# EAGLE design untitled (EAGLE 6.1)
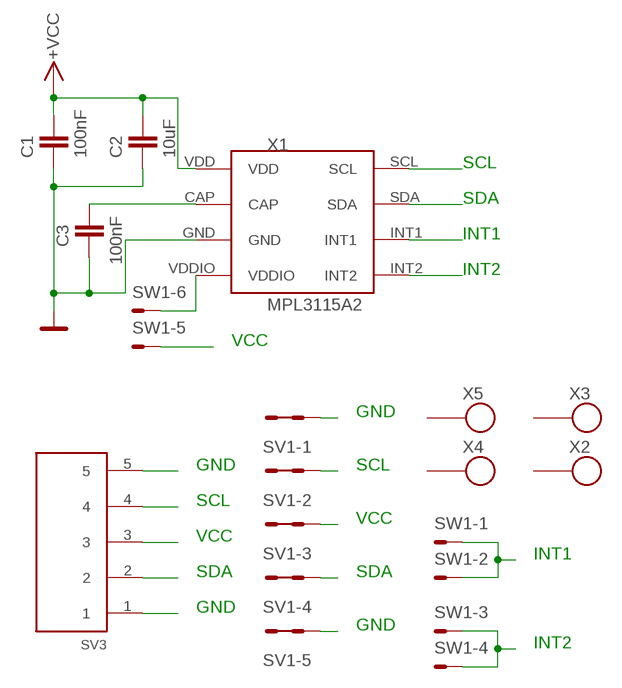
[diagram p0: schematic, sheet 1]

## Parts
C1  100nF  C-EUC0805  [C0805]
C2  10uF  C-EUC0805  [C0805]
C3  100nF  C-EUC0805  [C0805]
SV1  MA05-2  [MA05-2]
SV3  SMD_MA05-01  [SMD_MA05-1]
SW1  MA03-3  [MA03-2]
X1  MPL3115A2  [LGA]
X2  SROUB3M  [SROUB3M]
X3  SROUB3M  [SROUB3M]
X4  SROUB3M  [SROUB3M]
X5  SROUB3M  [SROUB3M]

## Nets
GND: C1.2 C2.2 C3.2 SV1.1 SV1.2 SV1.9 SV1.10 SV3.1 SV3.5 X1.GND
INT1: SW1.1 SW1.2 X1.INT1
INT2: SW1.3 SW1.4 X1.INT2
N$1: SW1.6 X1.VDDIO
N$3: C3.1 X1.CAP
SCL: SV1.3 SV1.4 SV3.4 X1.SCL
SDA: SV1.7 SV1.8 SV3.2 X1.SDA
VCC: C1.1 C2.1 SV1.5 SV1.6 SV3.3 SW1.5 X1.VDD ; supply symbol labelled +VCC
Unconnected: X2.P$1 X3.P$1 X4.P$1 X5.P$1

## Notes on the sheet
- SCL
- SDA
- INT1
- INT2
- VCC
- X5
- GND
- GND | SCL
- SCL
- VCC
- VCC
- INT1
- SDA | SDA
- GND
- GND
- INT2

## Library data of the parts
C1-C3 = rcl:C-EU: CAPACITOR, European symbol
SV1 = moje_hrebinky:MA05-2: PIN HEADER; OC_FARNELL: unknown; OC_NEWARK: unknown
SV3 = moje_hrebinky:SMD_MA05-01
SW1 = moje_hrebinky:MA03-3
X1 = moje_cidla:MPL3115A2: DIGITALNI CIDLO TLAKU A TEPLOTY MPL3115A2
X2-X5 = moje:SROUB3M

## Board
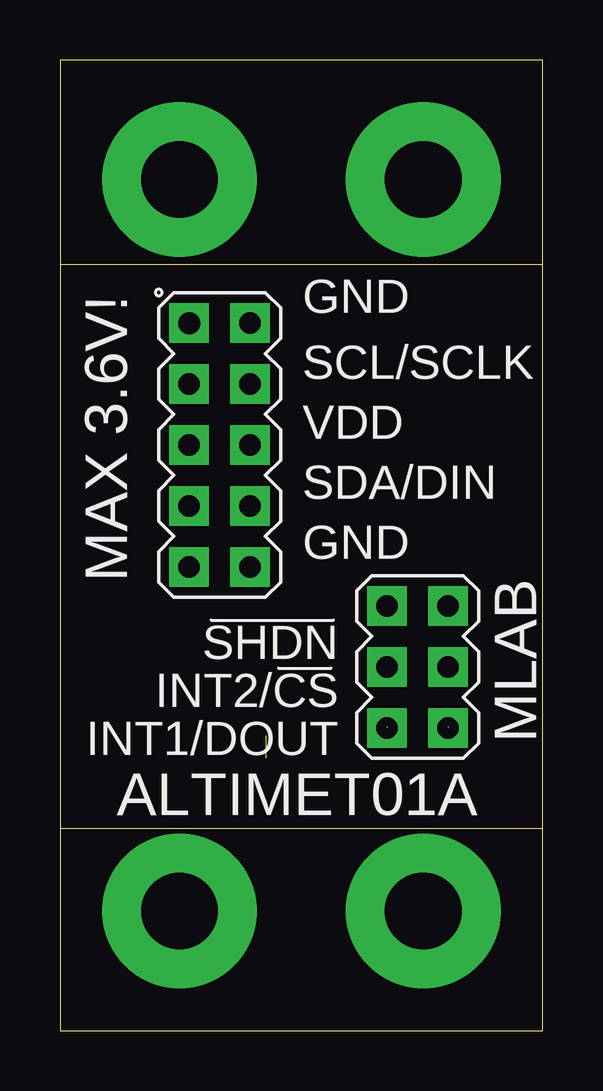
[diagram p1: board, top side]
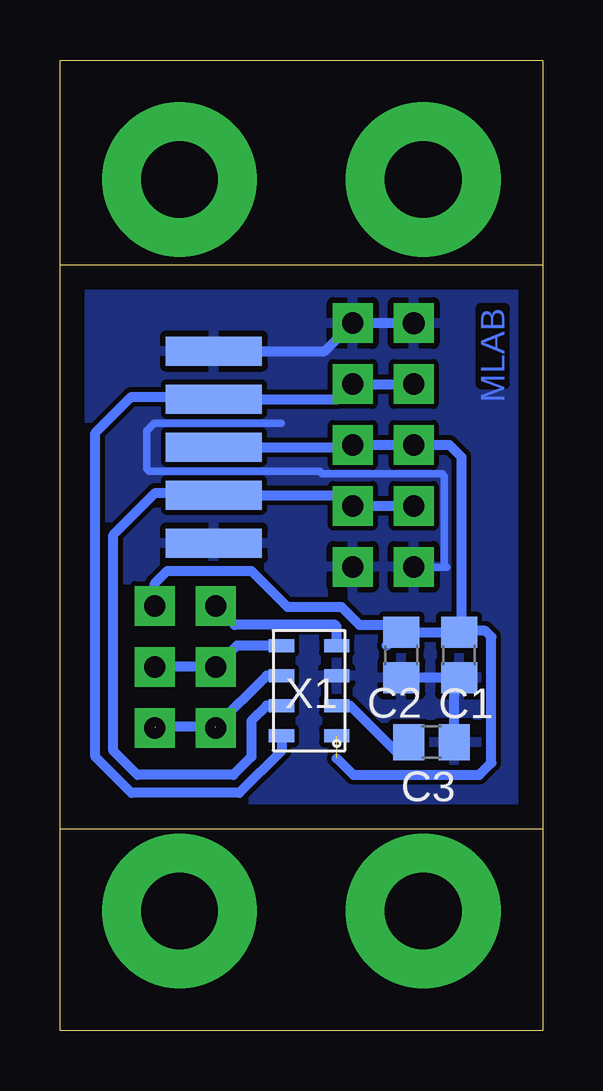
[diagram p2: board, bottom side, seen from below]

Size 20.12 x 40.44 mm. Coordinates in mm from the lower left corner, seen from the top.
Outline: 20.12,8.4 20.12,0 0,0 0,8.4
Outline: 20.12,8.4 20.12,31.9
Outline: 20.12,31.9 20.12,40.44 0,40.44 0,31.9
Outline: 0,31.9 0,8.4
Outline: 20.12,31.9 0,31.9
Outline: 20.12,8.4 0,8.4
Copper layers (1*16): Top 0.035mm / dielectric 1.5mm / Bottom 0.035mm
Design rules: minimum track width 10mil, minimum drill 24mil, track to track 8mil, track to pad 8mil, pad to pad 8mil, via to via 8mil, smd to smd 8mil, copper to edge 40mil, drill to drill 8mil, minimum pad ring 10mil, minimum via ring 8mil, stop-mask expansion 4mil, vias tented up to drill 0mil, thermal gap 10mil

### Footprints (pad centres in the part's own frame; a part is rotated, then mirrored left to right if it is on the bottom)
C0805 = smd 1.3 x 1.5: 1 -0.95,0; 2 0.95,0
MA05-2 = drill 0.914 pad 1.651 square: 1 -5.08,-1.27 | drill 0.889 pad 1.651 square: 2 -5.08,1.27; 3 -2.54,-1.27; 4 -2.54,1.27; 5 0,-1.27; 6 0,1.27; 7 2.54,-1.27; 8 2.54,1.27; 9 5.08,-1.27; 10 5.08,1.27
SMD_MA05-1 = smd 4 x 1.2: 1 0,-4; 2 0,-2; 3 0,0; 4 0,2; 5 0,4
MA03-2 = drill 0.889 pad 1.651 square: 1 -2.54,-1.27; 2 -2.54,1.27; 3 0,-1.27; 4 0,1.27; 5 2.54,-1.27; 6 2.54,1.27
LGA = smd 1.05 x 0.55: CAP -1.15,0.625; GND -1.15,-0.625; INT1 1.15,-0.625; INT2 1.15,-1.875; SCL 1.15,1.875; SDA 1.15,0.625; VDD -1.15,1.875; VDDIO -1.15,-1.875
SROUB3M = drill 3.2 pad 6.452: P$1 0,0

### Placement (x,y rotation side)
C1  3.49,15.65 270 bottom
C2  5.9,15.65 270 bottom
C3  4.64,12.02 0 bottom
SV1  6.65,24.4 270 top
SV3  13.71,24.31 0 bottom
SW1  14.9,15.15 90 top
X1  9.74,14.16 180 bottom
X2  4.98,4.98 0 top
X3  15.14,4.98 0 top
X4  4.98,35.46 180 top
X5  15.14,35.46 0 top

### Tracks (layer width: path | path; a pad name or v marks a point on that pad's centre or on a via)
GND
  Bottom 0.305: 10.9,25.3 16.2,25.3 16.5,25 16.5,23.4 16.4,23.3 9.3,23.3 9.2,23.2 4.2,23.2 4.1,23.1 4.1,19.4 4,19.3 5.36,19.3 SV1.9 | SV3.1 13.79,20.31 13.8,20.3
  Bottom 0.406: SV3.5 9.09,28.31 SV1.2 SV1.1 | C3.2 3.69,14 C1.2 C2.2
  pour Bottom: -0.1,31.9 -0.1,8.4 20.15,8.4 20.15,31.9
INT1  (2 unrouted)
  Bottom 0.406: X1.INT1 11.52,14.79 13.65,12.65 16.15,12.65
INT2
  Bottom 0.406: X1.INT2 12.75,16.04 SW1.4 SW1.3
N$1
  Bottom 0.406: X1.VDDIO 8.59,16.84 8.65,16.9 12.84,16.9 SW1.6
N$3
  Bottom 0.406: X1.CAP 8.04,13.54 6.15,11.65 5.9,11.65 5.59,11.96 C3.1
SCL
  Bottom 0.406: SV1.3 SV1.4 8.55,26.31 SV3.4 13.8,26.4 17.15,26.4 18.65,24.9 18.65,11.4 17.15,9.9 12.65,9.9 10.89,11.66 X1.SCL
SDA
  Bottom 0.406: SV1.7 SV1.8 8.37,22.31 SV3.2 13.8,22.4 16.15,22.4 17.9,20.65 17.9,11.65 16.9,10.65 12.9,10.65 12.15,11.4 12.15,12.9 11.52,13.54 X1.SDA
VCC  (1 unrouted)
  Bottom 0.406: C1.1 3.44,16.15 3.4,16.15 3.15,16.4 3.4,16.65 | SV3.3 8.01,24.31 SV1.6 SV1.5 3.9,24.4 3.4,23.9 3.4,16.65 | 3.4,16.65 2.4,16.65 2.15,16.4 2.15,11.15 2.65,10.65 7.9,10.65 8.59,11.34 | 6.52,16.04 5.9,16.65 C2.1 | C2.1 3.45,16.6 3.4,16.65 | SW1.5 16.17,18.63 15.65,19.15 12.15,19.15 10.65,17.65 8.4,17.65 7.65,16.9 6.2,16.9 C2.1

### Text on the board
Bottom: MLAB
tPlace: SHDN | INT2/CS | INT1/DOUT
tNames: GND | SCL/SCLK | VDD | SDA/DIN | GND | MAX 3.6V! | MLAB | ALTIMET01A
bNames: C1